# EAGLE design Board1_V4 (EAGLE 7.2.0)
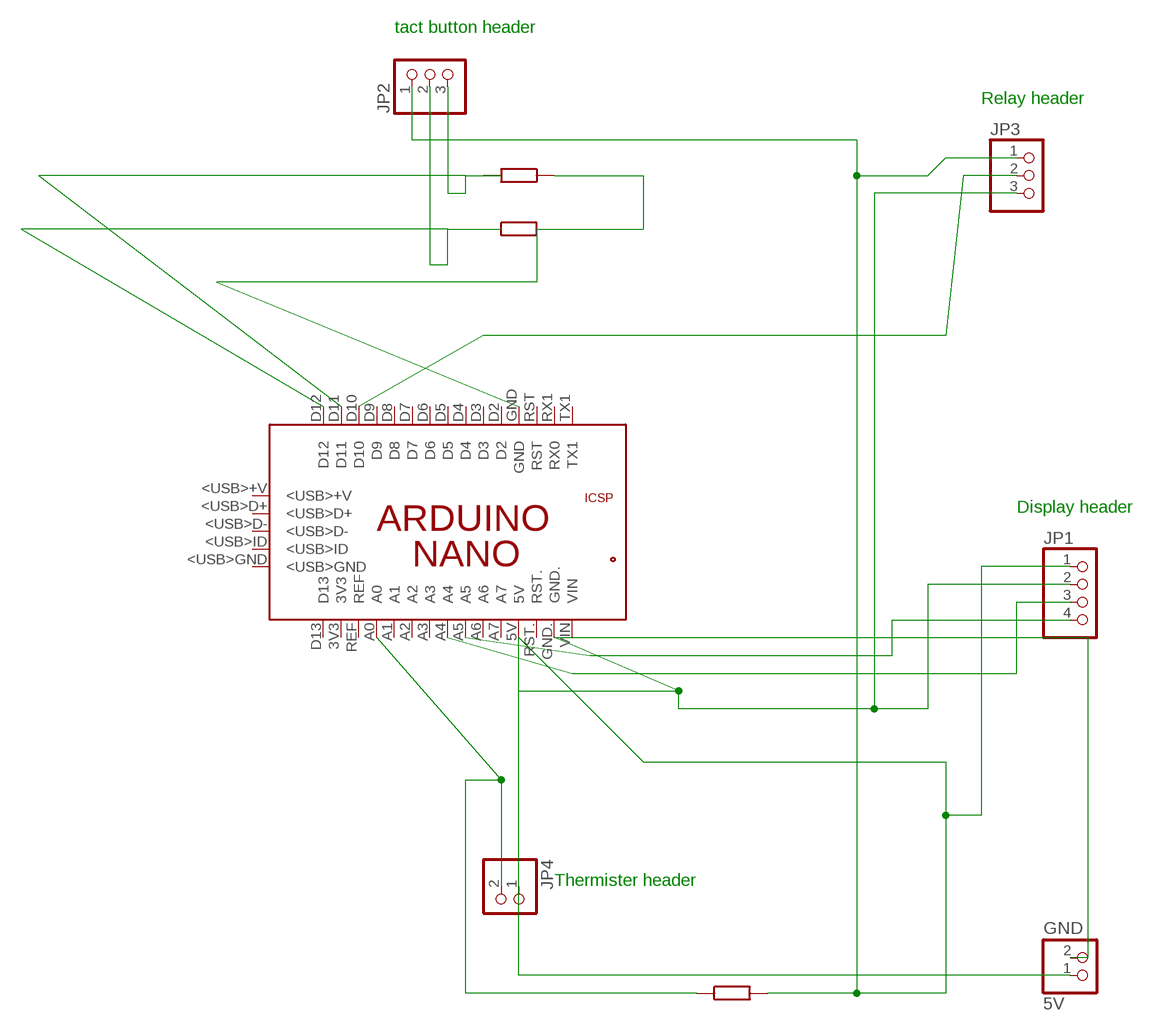
[diagram p0: schematic, sheet 1]

## Parts
5V  GND  PINHD-1X2/90  [1X02/90]
JP1  PINHD-1X4/90  [1X04/90]
JP2  PINHD-1X3/90  [1X03/90]
JP3  PINHD-1X3/90  [1X03/90]
JP4  PINHD-1X2/90  [1X02/90]
PCB1  ARDUINO_NANO  [ARDUINO_NANO]

## Nets
N$1: JP2.2 PCB1.D12
N$3: JP3.2 PCB1.D10
N$16: 5V.1 JP1.1 JP2.1 JP3.1 PCB1.5V
N$18: 5V.2 JP1.2 JP3.3 JP4.1 PCB1.GND.
N$19: JP1.4 PCB1.A5
N$20: JP1.3 PCB1.A4
N$24: JP4.2 PCB1.A0
N$44: PCB1.GND
N$45: JP2.3 PCB1.D11
Unconnected: PCB1.3V3 PCB1.5V. PCB1.<USB>+V PCB1.<USB>D+ PCB1.<USB>D- PCB1.<USB>GND PCB1.<USB>ID PCB1.A1 PCB1.A2 PCB1.A3 PCB1.A6 PCB1.A7 PCB1.D2 PCB1.D3 PCB1.D4 PCB1.D5 PCB1.D6 PCB1.D7 PCB1.D8 PCB1.D9 PCB1.D13 PCB1.GND_ PCB1.MISO PCB1.MOSI PCB1.REF PCB1.RESET.. PCB1.RST PCB1.RST. PCB1.RX1(RX0) PCB1.SCK PCB1.TX1 PCB1.VIN

## Notes on the sheet
- tact button header
- Relay header
- Display header
- Thermister header

## Library data of the parts
5V JP4 = pinhead:PINHD-1X2: PIN HEADER
JP1 = pinhead:PINHD-1X4: PIN HEADER
JP2 JP3 = pinhead:PINHD-1X3: PIN HEADER
PCB1 = E14_Arduino_revB:ARDUINO_NANO: Device for representing an Arduino Nano board with a footprint in an EAGLE design. Created by Dave Young for Element14. More EAGLE documentation at: http://www.element14.com/community/community/knode/cadsoft_eagle

## Board
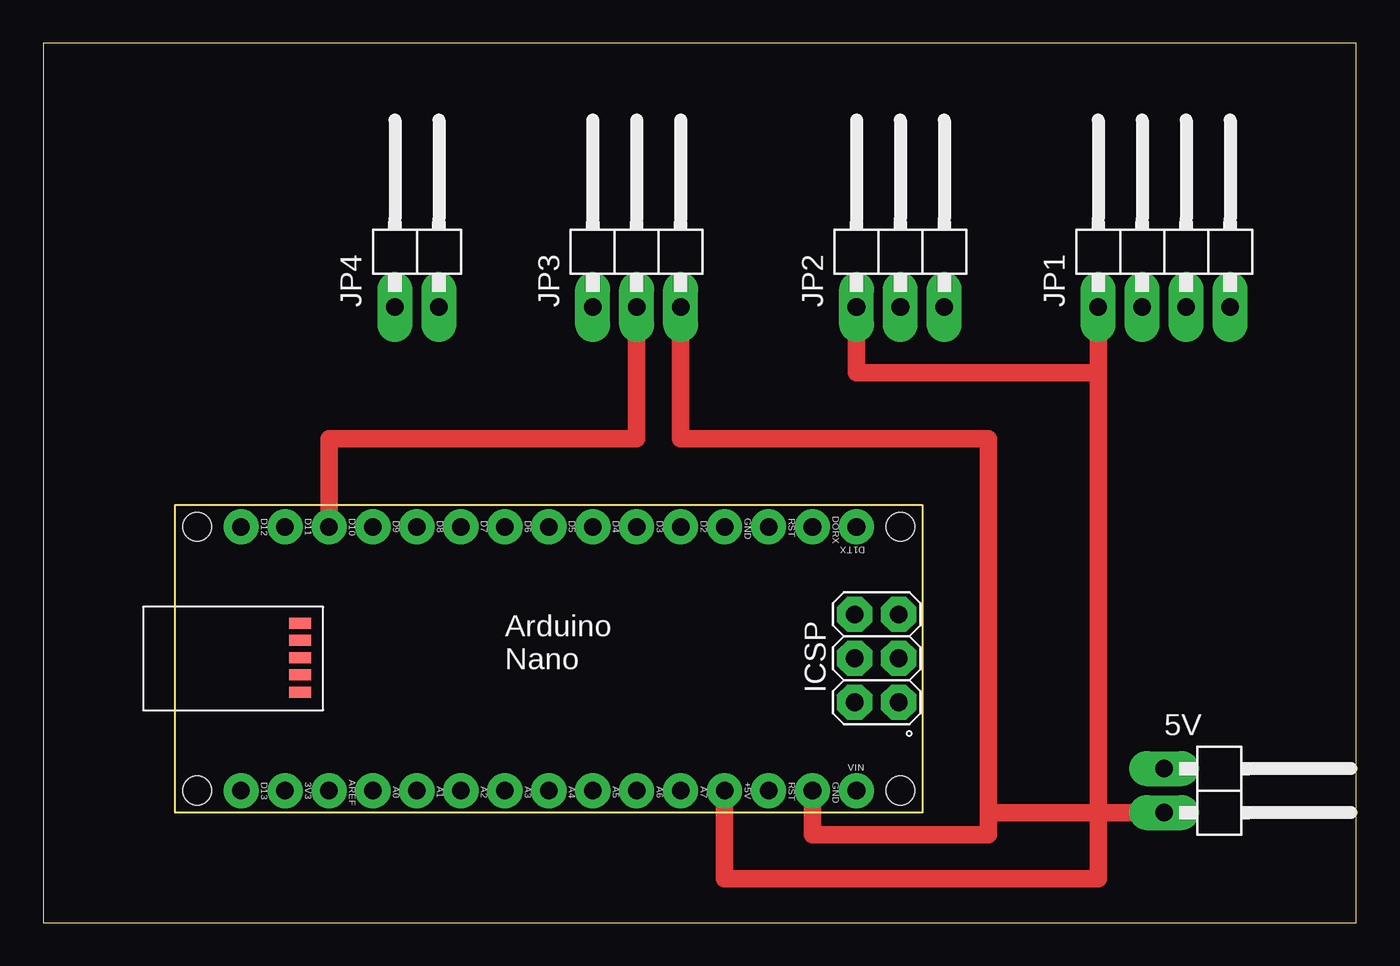
[diagram p1: board, top side]
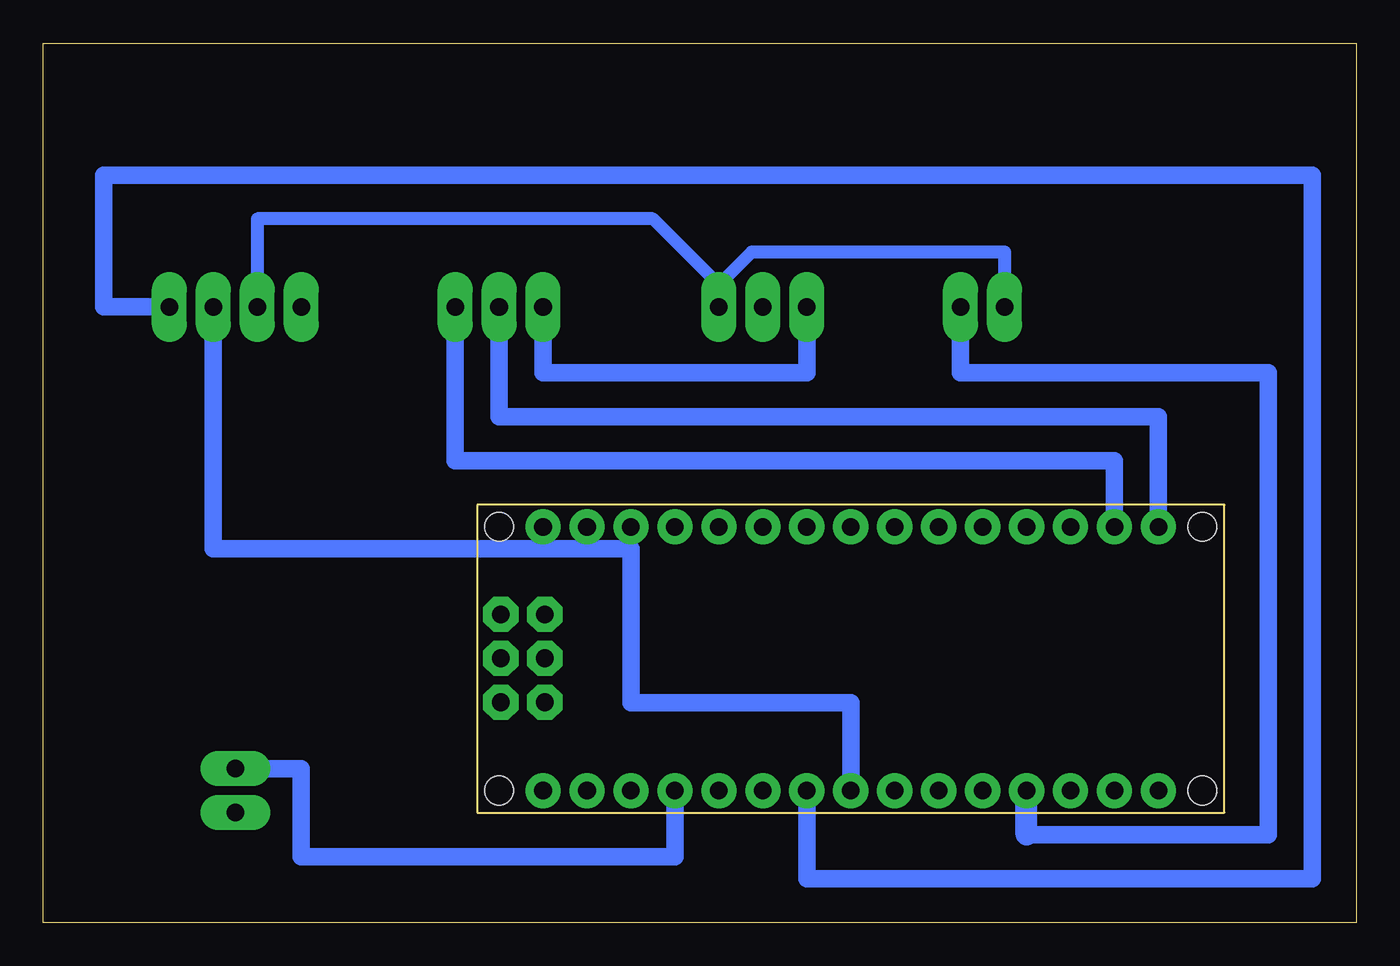
[diagram p2: board, bottom side, seen from below]

Size 75.87 x 50.79 mm. Coordinates in mm from the lower left corner, seen from the top.
Outline: 0,0 75.87,0 75.87,50.79 0,50.79 0,0
Copper layers (1*16): Top 0.035mm / dielectric 1.5mm / Bottom 0.035mm
Design rules "DesignRules_ShopBotBoard": minimum track width 30mil, minimum drill 24mil, track to track 30mil, track to pad 30mil, pad to pad 30mil, via to via 30mil, smd to smd 15mil, copper to edge 40mil, drill to drill 30mil, minimum pad ring 20mil, minimum via ring 20mil, stop-mask expansion 4mil, vias tented up to drill 0mil, thermal gap 10mil

### Footprints (pad centres in the part's own frame; a part is rotated, then mirrored left to right if it is on the bottom)
1X02/90 = drill 1.016 long: 1 -1.27,-3.81; 2 1.27,-3.81
1X04/90 = drill 1.016 long: 1 -3.81,-3.81; 2 -1.27,-3.81; 3 1.27,-3.81; 4 3.81,-3.81
1X03/90 = drill 1.016 long: 1 -2.54,-3.81; 2 0,-3.81; 3 2.54,-3.81
ARDUINO_NANO = drill 1.016 pad 1.778: 3V3 6.35,1.27; 5V 31.75,1.27; A0 11.43,1.27; A1 13.97,1.27; A2 16.51,1.27; A3 19.05,1.27; A4 21.59,1.27; A5 24.13,1.27; A6 26.67,1.27; A7 29.21,1.27; D2 29.21,16.51; D3 26.67,16.51; D4 24.13,16.51; D5 21.59,16.51; D6 19.05,16.51; D7 16.51,16.51; D8 13.97,16.51; D9 11.43,16.51; D10 8.89,16.51; D11 6.35,16.51; D12 3.81,16.51; D13 3.81,1.27; GND 31.75,16.51; GND. 36.83,1.27; REF 8.89,1.27; RST 34.29,16.51; RST. 34.29,1.27; RX1 36.83,16.51; TX1 39.37,16.51; VIN 39.37,1.27 | drill 1.016 pad 1.778 octagon: 5V. 39.268,6.375; GND_ 39.268,11.455; MISO 41.808,6.375; MOSI 39.268,8.915; RESET.. 41.808,11.455; SCK 41.808,8.915 | smd 1.27 x 0.635: <USB>+V 7.214,10.947; <USB>D+ 7.214,9.957; <USB>D- 7.214,8.941; <USB>GND 7.214,6.96; <USB>ID 7.214,7.976 | hole 1.651: 1.27,1.27; 1.27,16.51; 41.91,16.51; 41.91,1.27

### Placement (x,y rotation side)
5V  68.58,7.62 270 top
JP1  64.77,39.37 0 top
JP2  49.53,39.37 0 top
JP3  34.29,39.37 0 top
JP4  21.59,39.37 0 top
PCB1  7.62,6.35 0 top

### Tracks (layer width: path | path; a pad name or v marks a point on that pad's centre or on a via)
N$1
  Bottom 1.016: PCB1.D12 11.43,29.21 49.53,29.21 JP2.2
N$3
  Top 1.016: JP3.2 34.29,27.94 16.51,27.94 PCB1.D10
N$16
  Top 1.016: JP1.1 60.96,31.75 | JP2.1 46.99,31.75 60.96,31.75 | 60.96,31.75 60.96,2.54 39.37,2.54 PCB1.5V
  Bottom 0.254: 31.77,35.66 JP3.1 | 46.86,35.66 JP2.1
  Bottom 1.016: JP3.1 31.75,31.75 46.99,31.75 JP2.1 | 5V.1 60.96,8.89 60.96,3.81 39.37,3.81 PCB1.5V
N$18
  Top 0.254: 20.34,35.66 JP4.1 | 36.8,35.66 JP3.3 37.03,35.66
  Top 1.016: JP3.3 36.83,27.94 54.61,27.94 54.61,6.35 | PCB1.GND. 44.45,5.08 54.61,5.08 54.61,6.35 | 5V.2 54.61,6.35
  Bottom 0.762: JP4.1 20.32,38.73 34.92,38.73 36.83,36.83 | JP1.2 63.5,40.64 40.64,40.64 36.83,36.83 | 36.83,36.83 JP3.3
N$19
  Bottom 1.016: JP1.4 72.39,35.56 72.39,43.18 2.54,43.18 2.54,2.54 31.75,2.54 PCB1.A5
N$20
  Bottom 1.016: JP1.3 66.04,21.59 41.91,21.59 41.91,12.7 29.21,12.7 PCB1.A4
N$24
  Bottom 1.016: JP4.2 22.86,31.75 5.08,31.75 5.08,5.08 19.05,5.08
  Bottom 1.27: 19.05,5.08 PCB1.A0
N$45
  Bottom 1.016: PCB1.D11 13.97,26.67 52.07,26.67 JP2.3